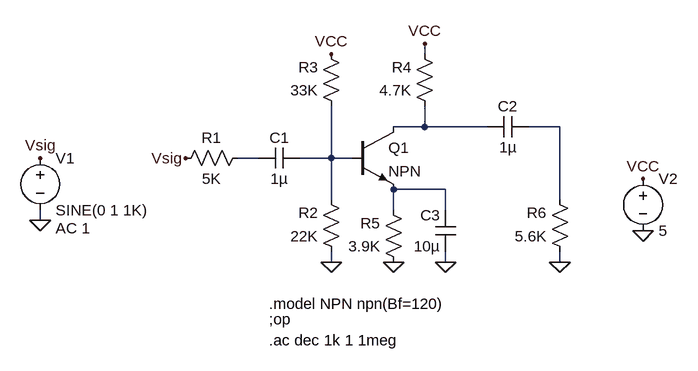
[diagram p0: schematic 83Henrique.asc]
83Henrique.asc, the LTspice schematic file:
Version 4
SHEET 1 952 680
WIRE 288 -416 288 -432
WIRE 288 -304 288 -336
WIRE 288 -304 240 -304
WIRE 384 -304 288 -304
WIRE 496 -304 448 -304
WIRE 32 -256 0 -256
WIRE 144 -256 144 -336
WIRE 144 -256 96 -256
WIRE 176 -256 144 -256
WIRE 320 -208 240 -208
WIRE 144 -192 144 -256
WIRE 496 -192 496 -304
WIRE 240 -176 240 -208
WIRE 320 -176 320 -208
WIRE -304 -160 -304 -176
WIRE 144 -96 144 -112
WIRE 320 -96 320 -112
WIRE 496 -96 496 -112
FLAG -304 -160 0
FLAG 144 -96 0
FLAG 240 -96 0
FLAG 320 -96 0
FLAG 496 -96 0
FLAG 624 -144 0
FLAG 624 -224 VCC
FLAG 288 -432 VCC
FLAG 144 -416 VCC
FLAG -304 -256 Vsig
FLAG -80 -256 Vsig
SYMBOL res 16 -272 R90
WINDOW 0 0 56 VBottom 2
WINDOW 3 32 56 VTop 2
SYMATTR InstName R1
SYMATTR Value 5K
SYMBOL res 160 -96 R180
WINDOW 0 36 76 Left 2
WINDOW 3 36 40 Left 2
SYMATTR InstName R2
SYMATTR Value 22K
SYMBOL res 160 -320 R180
WINDOW 0 36 76 Left 2
WINDOW 3 36 40 Left 2
SYMATTR InstName R3
SYMATTR Value 33K
SYMBOL res 304 -320 R180
WINDOW 0 36 76 Left 2
WINDOW 3 36 40 Left 2
SYMATTR InstName R4
SYMATTR Value 4.7K
SYMBOL res 256 -80 R180
WINDOW 0 36 76 Left 2
WINDOW 3 36 40 Left 2
SYMATTR InstName R5
SYMATTR Value 3.9K
SYMBOL res 512 -96 R180
WINDOW 0 36 76 Left 2
WINDOW 3 36 40 Left 2
SYMATTR InstName R6
SYMATTR Value 5.6K
SYMBOL cap 96 -272 R90
WINDOW 0 0 32 VBottom 2
WINDOW 3 32 32 VTop 2
SYMATTR InstName C1
SYMATTR Value 1µ
SYMBOL cap 448 -320 R90
WINDOW 0 0 32 VBottom 2
WINDOW 3 32 32 VTop 2
SYMATTR InstName C2
SYMATTR Value 1µ
SYMBOL cap 336 -112 R180
WINDOW 0 24 56 Left 2
WINDOW 3 24 8 Left 2
SYMATTR InstName C3
SYMATTR Value 10µ
SYMBOL voltage -304 -272 R0
WINDOW 123 24 124 Left 2
WINDOW 39 0 0 Left 0
SYMATTR Value2 AC 1
SYMATTR InstName V1
SYMATTR Value SINE(0 1 1K)
SYMBOL npn 176 -304 R0
SYMATTR InstName Q1
SYMBOL voltage 624 -240 R0
WINDOW 123 0 0 Left 0
WINDOW 39 0 0 Left 0
SYMATTR InstName V2
SYMATTR Value 5
TEXT 48 -8 Left 2 !;op
TEXT 48 -32 Left 2 !.model NPN npn(Bf=120)
TEXT 48 24 Left 2 !.ac dec 1k 1 1meg

The netlist it stands for:
* 83Henrique.asc
R1 N003 Vsig 5K
R2 0 N004 22K
R3 N004 VCC 33K
R4 N001 VCC 4.7K
R5 0 N005 3.9K
R6 0 N002 5.6K
C1 N004 N003 1µ
C2 N002 N001 1µ
C3 0 N005 10µ
V1 Vsig 0 SINE(0 1 1K) AC 1
Q1 N001 N004 N005 0 NPN
V2 VCC 0 5
.model NPN NPN
.model PNP PNP
.lib standard.bjt
;op
.model NPN npn(Bf=120)
.ac dec 1k 1 1meg
.backanno
.end